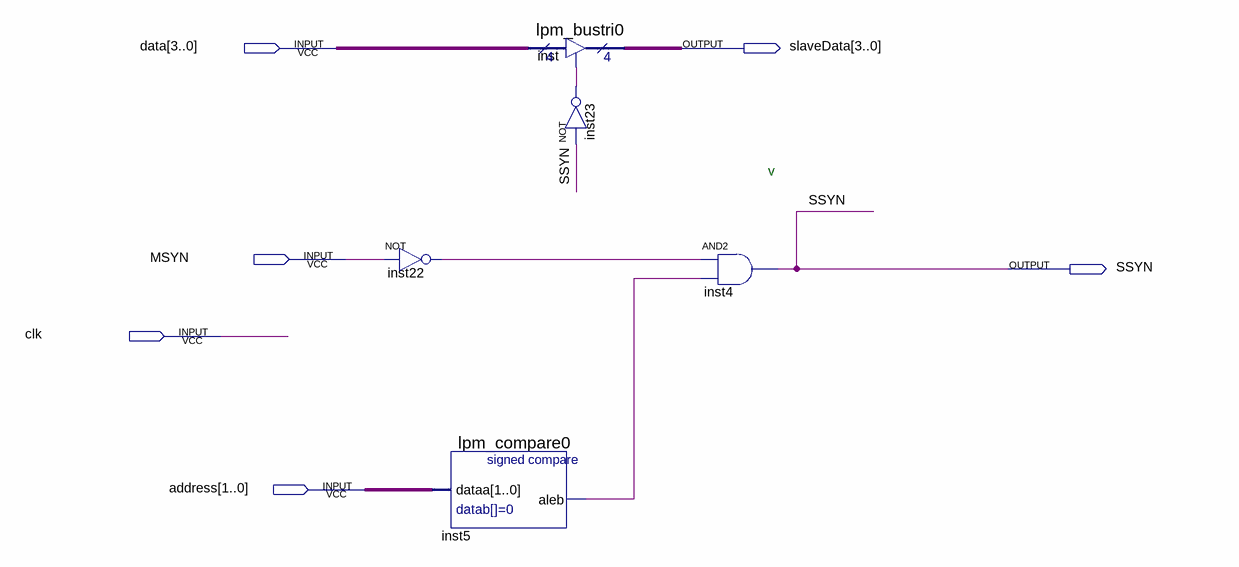
[diagram p0: schematic sheet]
// Quartus schematic slave1.bdf as structural Verilog: 5 symbols, 6 pins
module slave1 (
  input  [3:0] data,
  input  MSYN,
  input  clk,
  input  [1:0] address,
  output [3:0] slaveData,
  output SSYN
);

  wire inst5_aleb, inst22_out, inst23_out;

  not inst22 (inst22_out, MSYN);
  lpm_compare0 inst5 (.dataa(address), .aleb(inst5_aleb));
  lpm_bustri0 inst (.enabledt(inst23_out), .data(data), .tridata(slaveData));
  not inst23 (inst23_out, SSYN);
  and inst4 (SSYN, inst22_out, inst5_aleb);

  // Notes on the sheet:
  //   v
endmodule
